# EAGLE schematic main (EAGLE 6.1)
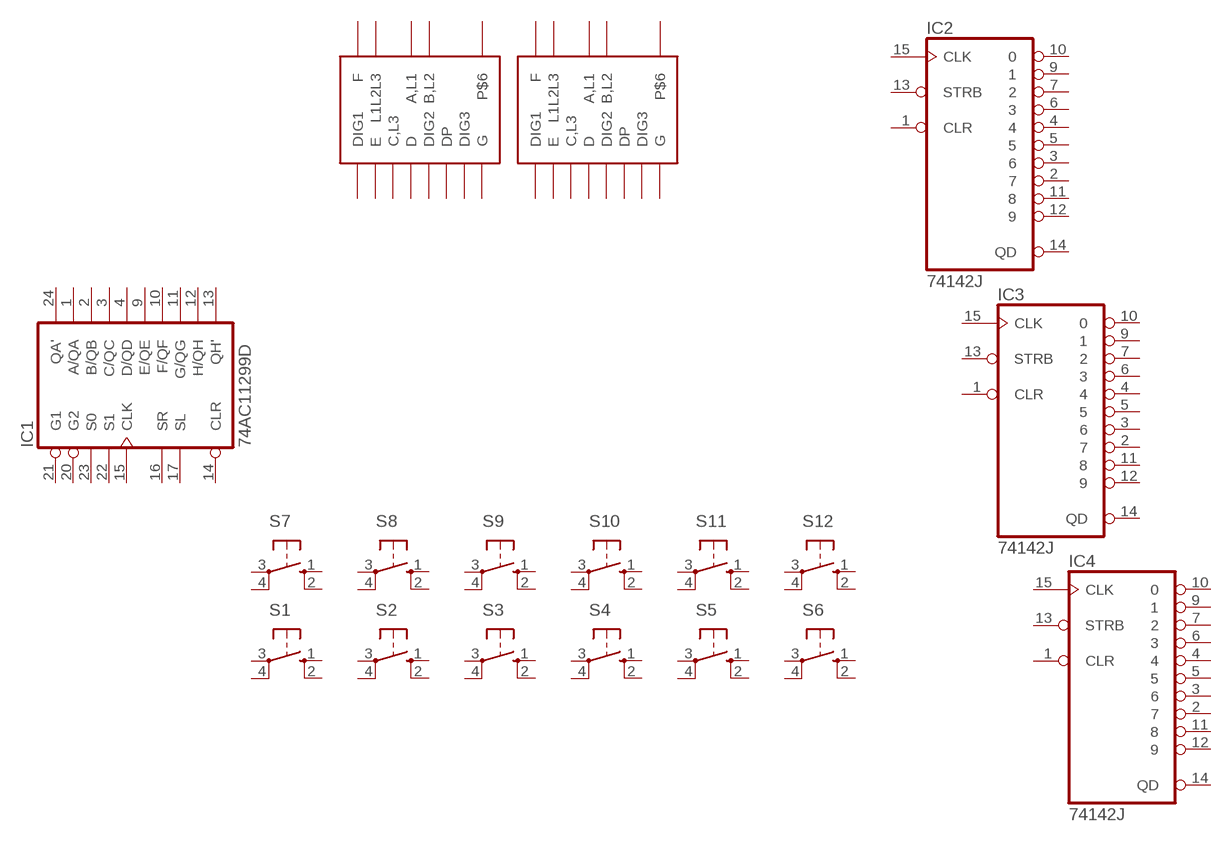
[diagram p0: schematic, sheet 1]

## Parts
IC1  74AC11299D  [SO24W]
IC2  74142J  [SO16]
IC3  74142J  [SO16]
IC4  74142J  [SO16]
S1  10-XX  [B3F-10XX]
S2  10-XX  [B3F-10XX]
S3  10-XX  [B3F-10XX]
S4  10-XX  [B3F-10XX]
S5  10-XX  [B3F-10XX]
S6  10-XX  [B3F-10XX]
S7  10-XX  [B3F-10XX]
S8  10-XX  [B3F-10XX]
S9  10-XX  [B3F-10XX]
S10  10-XX  [B3F-10XX]
S11  10-XX  [B3F-10XX]
S12  10-XX  [B3F-10XX]
U$1  SEG4X7  [HDSP-R]
U$2  SEG4X7  [HDSP-R]
Unconnected: IC1.1(A/QA) IC1.2(B/QB) IC1.3(C/QC) IC1.4(D/QD) IC1.9(E/QE) IC1.10(F/QF) IC1.11(G/QG) IC1.12(H/QH) IC1.13(QH') IC1.14(CLR) IC1.15(CLK) IC1.16(SR) IC1.17(SL) IC1.20(G2) IC1.21(G1) IC1.22(S1) IC1.23(S0) IC1.24(QA') IC2.1(CLR) IC2.2 IC2.3 IC2.4 IC2.5 IC2.6 IC2.7 IC2.9 IC2.10 IC2.11 IC2.12 IC2.13(STRB) IC2.14(QD) IC2.15(CLK) IC3.1(CLR) IC3.2 IC3.3 IC3.4 IC3.5 IC3.6 IC3.7 IC3.9 IC3.10 IC3.11 IC3.12 IC3.13(STRB) IC3.14(QD) IC3.15(CLK) IC4.1(CLR) IC4.2 IC4.3 IC4.4 IC4.5 IC4.6 IC4.7 IC4.9 IC4.10 IC4.11 IC4.12 IC4.13(STRB) IC4.14(QD) IC4.15(CLK) S1.1(S) S1.2(S1) S1.3(P) S1.4(P1) S2.1(S) S2.2(S1) S2.3(P) S2.4(P1) S3.1(S) S3.2(S1) S3.3(P) S3.4(P1) S4.1(S) S4.2(S1) S4.3(P) S4.4(P1) S5.1(S) S5.2(S1) S5.3(P) S5.4(P1) S6.1(S) S6.2(S1) S6.3(P) S6.4(P1) S7.1(S) S7.2(S1) S7.3(P) S7.4(P1) S8.1(S) S8.2(S1) S8.3(P) S8.4(P1) S9.1(S) S9.2(S1) S9.3(P) S9.4(P1) S10.1(S) S10.2(S1) S10.3(P) S10.4(P1) S11.1(S) S11.2(S1) S11.3(P) S11.4(P1) S12.1(S) S12.2(S1) S12.3(P) S12.4(P1) U$1.A,L1 U$1.B,L2 U$1.C,L3 U$1.D U$1.DIG1 U$1.DIG2 U$1.DIG3 U$1.DP U$1.E U$1.F U$1.G U$1.L1,L2,L3(L1L2L3) U$1.NULL U$2.A,L1 U$2.B,L2 U$2.C,L3 U$2.D U$2.DIG1 U$2.DIG2 U$2.DIG3 U$2.DP U$2.E U$2.F U$2.G U$2.L1,L2,L3(L1L2L3) U$2.NULL

## Power pins joined to a net without a drawn wire
GND: IC1.5(GND) IC1.6(GND) IC1.7(GND) IC1.8(GND) IC2.8(GND) IC3.8(GND) IC4.8(GND)
VCC: IC1.18(VCC) IC1.19(VCC) IC2.16(VCC) IC3.16(VCC) IC4.16(VCC)

## Library data of the parts
IC1 = 74ac-logic:74AC11299: 8-bit universal SHIFT/STORAGE REGISTER
IC2-IC4 = 74xx-eu:74*142: Decimal COUNTER and BCD to decimal DECODER
S1-S12 = switch-omron:10-XX: OMRON SWITCH; MPN: B3F-1000; OC_FARNELL: 176432; OC_NEWARK: 36M3542
U$1 U$2 = 7SEGx3:SEG4X7